# EAGLE design Power_Distro_Board (EAGLE 8.3.2)
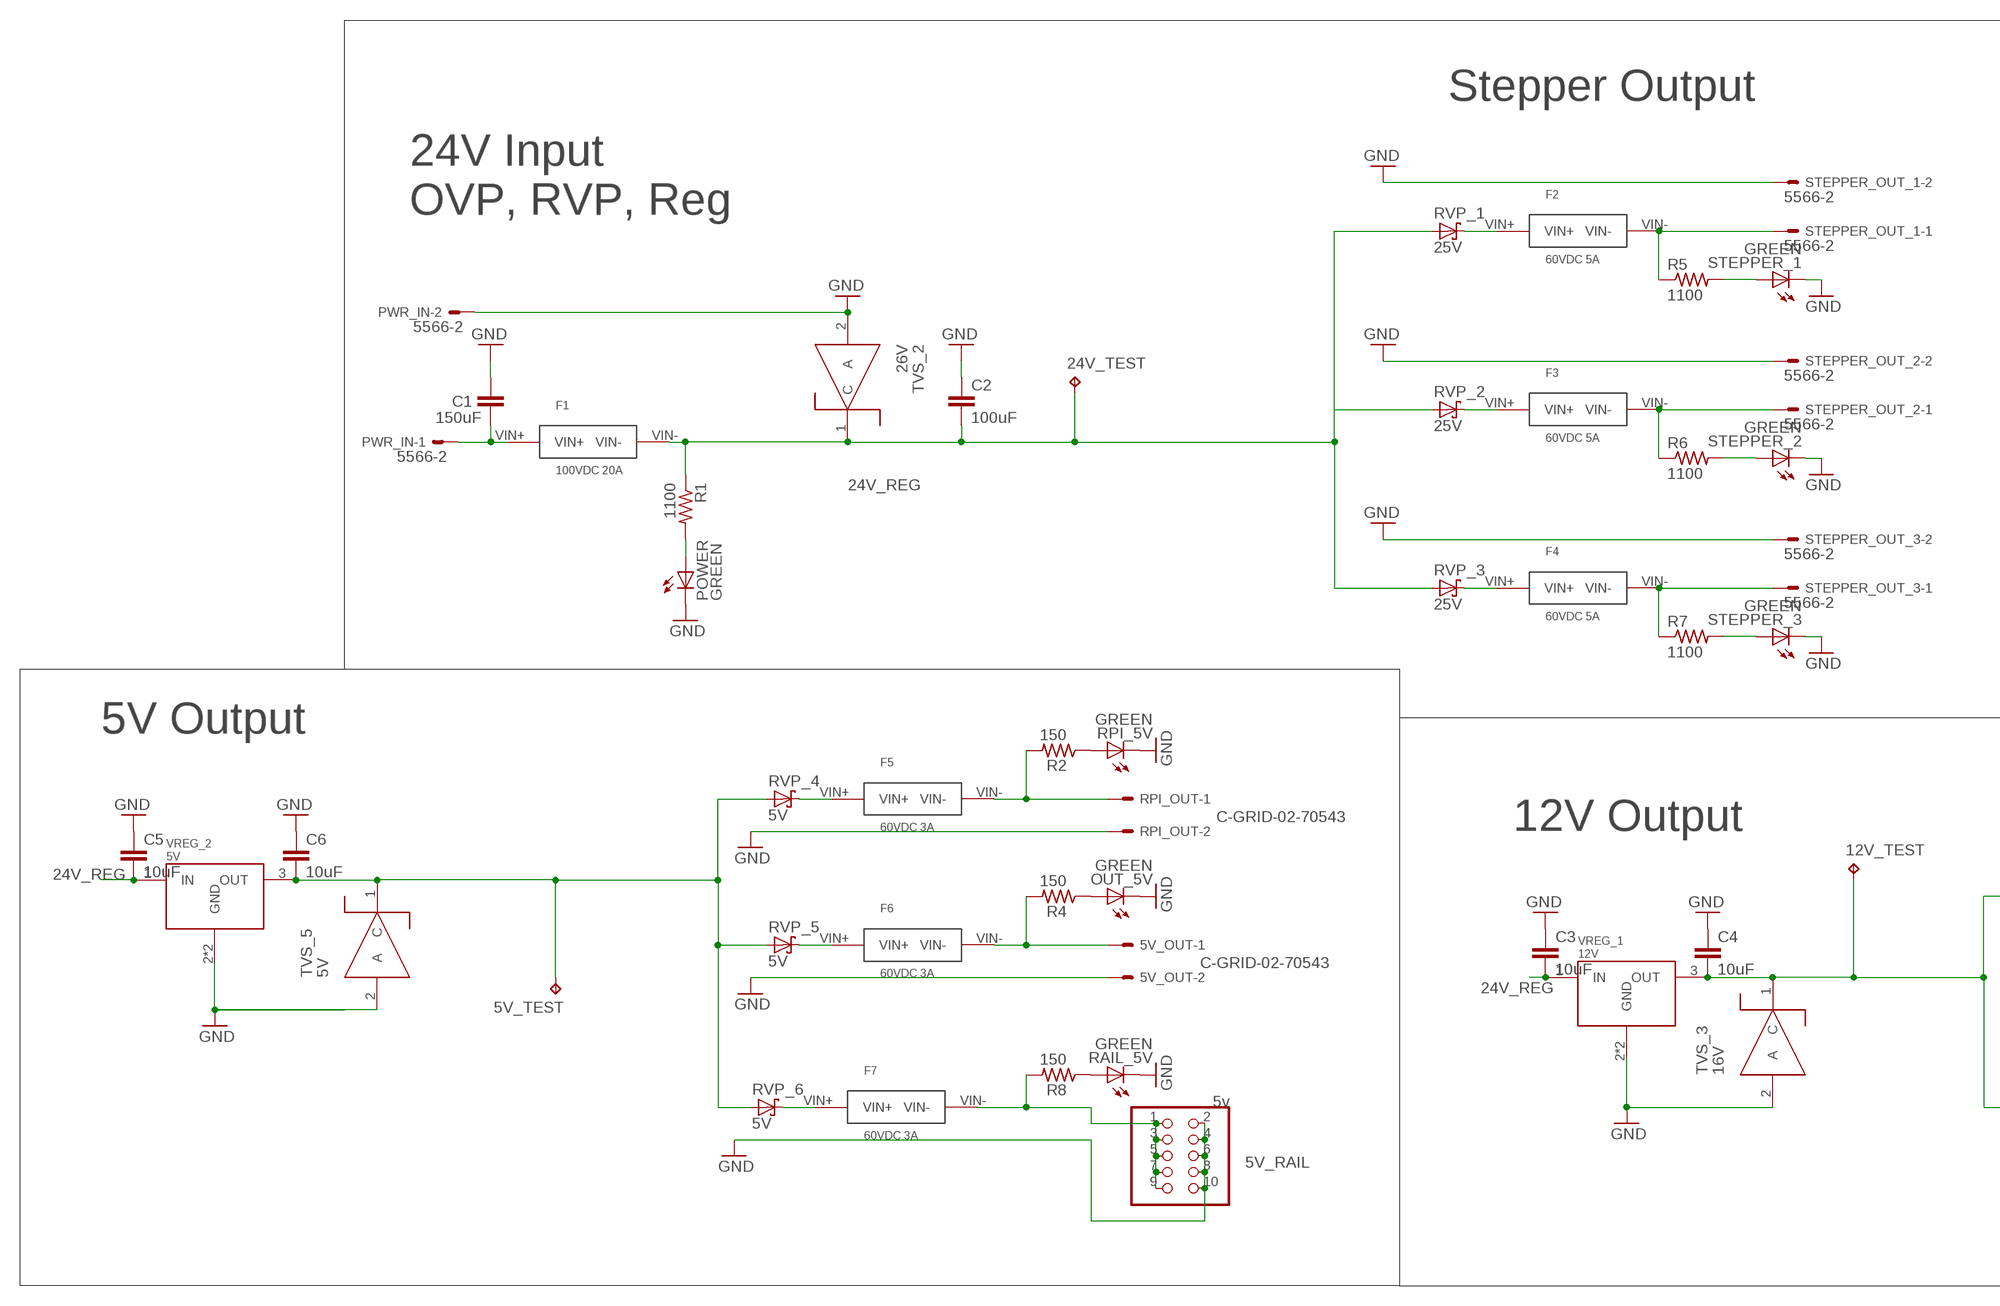
[diagram p0: schematic, sheet 1, part 1 of 2]
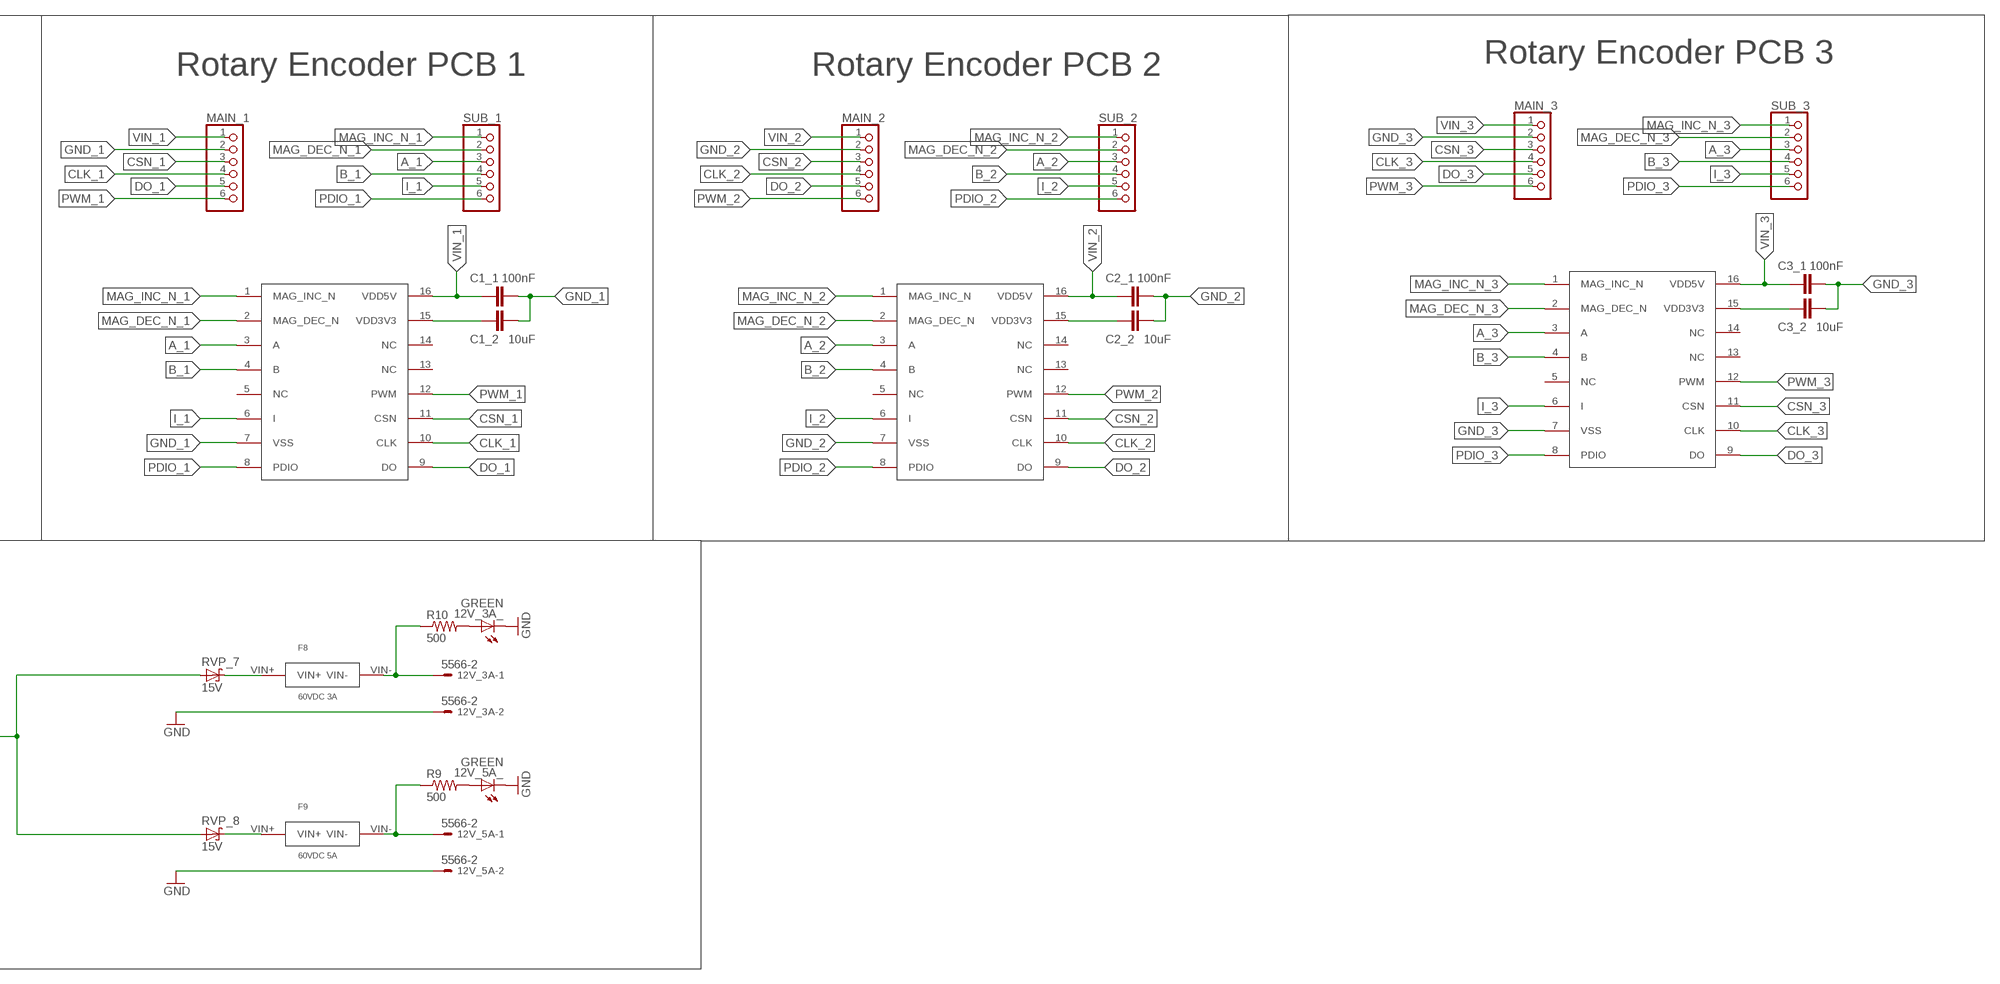
[diagram p1: schematic, sheet 1, part 2 of 2]

## Parts
5V_OUT  C-GRID-02-70543  [70543-02]
5V_RAIL  5v  PINHD-2X5  [2X05]
5V_TEST  TPPAD1-13  [P1-13]
12V_3A  5566-2  [5566-2]
12V_3A_  GREEN  LEDSML1206  [SML1206]
12V_5A  5566-2  [5566-2]
12V_5A_  GREEN  LEDSML1206  [SML1206]
12V_TEST  TPPAD1-13  [P1-13]
24V_TEST  TPPAD1-13  [P1-13]
C1  150uF  C-EUC1206  [C1206]
C1_1  100nF  C-EUC1206  [C1206]
C1_2  10uF  C-EUC1206  [C1206]
C2  100uF  C-EUC1206  [C1206]
C2_1  100nF  C-EUC1206  [C1206]
C2_2  10uF  C-EUC1206  [C1206]
C3  10uF  C-EUC1206  [C1206]
C3_1  100nF  C-EUC1206  [C1206]
C3_2  10uF  C-EUC1206  [C1206]
C4  10uF  C-EUC1206  [C1206]
C5  10uF  C-EUC1206  [C1206]
C6  10uF  C-EUC1206  [C1206]
ENC_1  ENCODER_AS5045B  [SSOP16]
ENC_2  ENCODER_AS5045B  [SSOP16]
ENC_3  ENCODER_AS5045B  [SSOP16]
F1  100VDC 20A  LITTLEFUSENANO463  [NANO]
F2  60VDC 5A  LITTLEFUSE0154  [OMNI_BLOCK]
F3  60VDC 5A  LITTLEFUSE0154  [OMNI_BLOCK]
F4  60VDC 5A  LITTLEFUSE0154  [OMNI_BLOCK]
F5  60VDC 3A  LITTLEFUSE0154  [OMNI_BLOCK]
F6  60VDC 3A  LITTLEFUSE0154  [OMNI_BLOCK]
F7  60VDC 3A  LITTLEFUSE0154  [OMNI_BLOCK]
F8  60VDC 3A  LITTLEFUSE0154  [OMNI_BLOCK]
F9  60VDC 5A  LITTLEFUSE0154  [OMNI_BLOCK]
MAIN_1  PINHD-1X6  [1X06]
MAIN_2  PINHD-1X6  [1X06]
MAIN_3  PINHD-1X6  [1X06]
OUT_5V  GREEN  LEDSML1206  [SML1206]
POWER  GREEN  LEDSML1206  [SML1206]
PWR_IN  5566-2  [5566-2]
R1  1100  R-US_R1206  [R1206]
R2  150  R-US_R1206  [R1206]
R4  150  R-US_R1206  [R1206]
R5  1100  R-US_R1206  [R1206]
R6  1100  R-US_R1206  [R1206]
R7  1100  R-US_R1206  [R1206]
R8  150  R-US_R1206  [R1206]
R9  500  R-US_R1206  [R1206]
R10  500  R-US_R1206  [R1206]
RAIL_5V  GREEN  LEDSML1206  [SML1206]
RPI_5V  GREEN  LEDSML1206  [SML1206]
RPI_OUT  C-GRID-02-70543  [70543-02]
RVP_1  25V  SCHOTTKY-DIODESMC  [SMC]
RVP_2  25V  SCHOTTKY-DIODESMC  [SMC]
RVP_3  25V  SCHOTTKY-DIODESMC  [SMC]
RVP_4  5V  SCHOTTKY-DIODESMC  [SMC]
RVP_5  5V  SCHOTTKY-DIODESMC  [SMC]
RVP_6  5V  SCHOTTKY-DIODESMC  [SMC]
RVP_7  15V  SCHOTTKY-DIODESMC  [SMC]
RVP_8  15V  SCHOTTKY-DIODESMC  [SMC]
STEPPER_1  GREEN  LEDSML1206  [SML1206]
STEPPER_2  GREEN  LEDSML1206  [SML1206]
STEPPER_3  GREEN  LEDSML1206  [SML1206]
STEPPER_OUT_1  5566-2  [5566-2]
STEPPER_OUT_2  5566-2  [5566-2]
STEPPER_OUT_3  5566-2  [5566-2]
SUB_1  PINHD-1X6  [1X06]
SUB_2  PINHD-1X6  [1X06]
SUB_3  PINHD-1X6  [1X06]
TVS_2  26V  SMAJ26A_TVSSMA  [DO-214AC]
TVS_3  16V  PRSMA16_TVS  [DO-214AC]
TVS_5  5V  SMAJ5.0_TVSSMA  [DO-214AC]
VREG_1  12V  HIGH-CURRENT_REGSMA  [TO-263-3]
VREG_2  5V  HIGH-CURRENT_REGSMA  [TO-263-3]

## Nets
5V_REG: 5V_TEST.TP C6.2 RVP_4.A RVP_5.A RVP_6.A TVS_5.1(C) VREG_2.3(OUT)
5V_REG1: F5.VIN- R2.2 RPI_OUT.1
5V_REG2: 5V_OUT.1 F6.VIN- R4.2
5V_REG3: 5V_RAIL.1 5V_RAIL.3 5V_RAIL.5 5V_RAIL.7 5V_RAIL.9 F7.VIN- R8.2
12V_REG: 12V_TEST.TP C4.2 RVP_7.A RVP_8.A TVS_3.1(C) VREG_1.3(OUT)
12V_REG1: 12V_5A.1 F9.VIN- R9.1
12V_REG2: 12V_3A.1 F8.VIN- R10.1
24V_REG: 24V_TEST.TP C2.2 C3.2 C5.2 F1.VIN- R1.1 RVP_1.A RVP_2.A RVP_3.A TVS_2.1(C) VREG_1.1(IN) VREG_2.1(IN)
A_1: ENC_1.3(A) SUB_1.3
A_2: ENC_2.3(A) SUB_2.3
A_3: ENC_3.3(A) SUB_3.3
B_1: ENC_1.4(B) SUB_1.4
B_2: ENC_2.4(B) SUB_2.4
B_3: ENC_3.4(B) SUB_3.4
CLK_1: ENC_1.10(CLK) MAIN_1.4
CLK_2: ENC_2.10(CLK) MAIN_2.4
CLK_3: ENC_3.10(CLK) MAIN_3.4
CSN_1: ENC_1.11(CSN) MAIN_1.3
CSN_2: ENC_2.11(CSN) MAIN_2.3
CSN_3: ENC_3.11(CSN) MAIN_3.3
DO_1: ENC_1.9(DO) MAIN_1.5
DO_2: ENC_2.9(DO) MAIN_2.5
DO_3: ENC_3.9(DO) MAIN_3.5
GND: 5V_OUT.2 5V_RAIL.2 5V_RAIL.4 5V_RAIL.6 5V_RAIL.8 5V_RAIL.10 12V_3A.2 12V_3A_.C 12V_5A.2 12V_5A_.C C1.1 C2.1 C3.1 C4.1 C5.1 C6.1 OUT_5V.C POWER.C PWR_IN.2 RAIL_5V.C RPI_5V.C RPI_OUT.2 STEPPER_1.C STEPPER_2.C STEPPER_3.C STEPPER_OUT_1.2 STEPPER_OUT_2.2 STEPPER_OUT_3.2 TVS_2.2(A) TVS_3.2(A) TVS_5.2(A) VREG_1.2(GND) VREG_1.4(GND) VREG_2.2(GND) VREG_2.4(GND)
GND_1: C1_1.2 C1_2.2 ENC_1.7(VSS) MAIN_1.2
GND_2: C2_1.2 C2_2.2 ENC_2.7(VSS) MAIN_2.2
GND_3: C3_1.2 C3_2.2 ENC_3.7(VSS) MAIN_3.2
I_1: ENC_1.6(I) SUB_1.5
I_2: ENC_2.6(I) SUB_2.5
I_3: ENC_3.6(I) SUB_3.5
MAG_DEC_N_1: ENC_1.2(MAG_DEC_N) SUB_1.2
MAG_DEC_N_2: ENC_2.2(MAG_DEC_N) SUB_2.2
MAG_DEC_N_3: ENC_3.2(MAG_DEC_N) SUB_3.2
MAG_INC_N_1: ENC_1.1(MAG_INC_N) SUB_1.1
MAG_INC_N_2: ENC_2.1(MAG_INC_N) SUB_2.1
MAG_INC_N_3: ENC_3.1(MAG_INC_N) SUB_3.1
N$1: POWER.A R1.2
N$2: C2_2.1 ENC_2.15(VDD3V3)
N$3: C1.2 F1.VIN+ PWR_IN.1
N$4: C1_2.1 ENC_1.15(VDD3V3)
N$5: F2.VIN+ RVP_1.C
N$6: C3_2.1 ENC_3.15(VDD3V3)
N$8: F5.VIN+ RVP_4.C
N$9: R5.2 STEPPER_1.A
N$10: R2.1 RPI_5V.A
N$11: R8.1 RAIL_5V.A
N$12: F2.VIN- R5.1 STEPPER_OUT_1.1
N$14: F3.VIN+ RVP_2.C
N$16: R6.2 STEPPER_2.A
N$17: 12V_5A_.A R9.2
N$18: F3.VIN- R6.1 STEPPER_OUT_2.1
N$20: OUT_5V.A R4.1
N$22: F4.VIN+ RVP_3.C
N$24: R7.2 STEPPER_3.A
N$25: F4.VIN- R7.1 STEPPER_OUT_3.1
N$28: F6.VIN+ RVP_5.C
N$29: 12V_3A_.A R10.2
N$32: F7.VIN+ RVP_6.C
N$35: F8.VIN+ RVP_7.C
N$36: F9.VIN+ RVP_8.C
PDIO_1: ENC_1.8(PDIO) SUB_1.6
PDIO_2: ENC_2.8(PDIO) SUB_2.6
PDIO_3: ENC_3.8(PDIO) SUB_3.6
PWM_1: ENC_1.12(PWM) MAIN_1.6
PWM_2: ENC_2.12(PWM) MAIN_2.6
PWM_3: ENC_3.12(PWM) MAIN_3.6
VIN_1: C1_1.1 ENC_1.16(VDD5V) MAIN_1.1
VIN_2: C2_1.1 ENC_2.16(VDD5V) MAIN_2.1
VIN_3: C3_1.1 ENC_3.16(VDD5V) MAIN_3.1
Unconnected: ENC_1.5(NC) ENC_1.13(NC) ENC_1.14(NC) ENC_2.5(NC) ENC_2.13(NC) ENC_2.14(NC) ENC_3.5(NC) ENC_3.13(NC) ENC_3.14(NC)

## Notes on the sheet
- **These 3 encoder PCBs will be cut out of the main board
- Rotary Encoder PCB 3
- Stepper Output | Rotary Encoder PCB 1 | Rotary Encoder PCB 2
- 24V Input 
  OVP, RVP, Reg
- 5V Output
- 12V Output

## Library data of the parts
5V_OUT RPI_OUT = con-molex:C-GRID-02: CONNECTOR wire to board 2.54 mm (0.100") pitch header; OC_FARNELL: unknown; OC_NEWARK: unknown
5V_RAIL = pinhead:PINHD-2X5: PIN HEADER
5V_TEST 12V_TEST 24V_TEST = testpad:TP: Test pad
12V_3A 12V_5A PWR_IN STEPPER_OUT_1-STEPPER_OUT_3 = con-molex:5566-2: Mini FIT connector 2 pol Source: http://www.molex.com; OC_FARNELL: 1822072; OC_NEWARK: unknown
12V_3A_ 12V_5A_ OUT_5V POWER RAIL_5V RPI_5V STEPPER_1-STEPPER_3 = led:LED: LED OSRAM: - CHIPLED LG R971, LG N971, LY N971, LG Q971, LY Q971, LO R971, LY R971 LH N974, LH R974 LS Q976, LO Q976, LY Q976 LO Q996 - Hyper CHIPLED LW Q18S LB Q993, LB Q99A, LB R99A - SideLED LS A670, LO A670, LY A670, LG A670, LP A670 LB A673, LV A673, LT A673, LW A673 LH A674 LY A675 LS A676, LA A676, LO A676, LY A676, LW A676 LS A679, LY A679, LG A679 - Hyper Micro SIDELED® LS Y876, LA Y876, LO Y876, LY Y876 LT Y87S - SmartLED LW L88C, LW L88S LB L89C, LB L89S, LG L890 LS L89K, LO L89K, LY L89K LS L896, LA L896, LO L896, LY L896 - TOPLED LS T670, LO T670, LY T670, LG T670, LP T670 LSG T670, LSP T670, LSY T670, LOP T670, LYG T670 LG T671, LOG T671, LSG T671 LB T673, LV T673, LT T673, LW T673 LH T674 LS T676, LA T676, LO T676, LY T676, LB T676, LH T676, LSB T676, LW T676 LB T67C, LV T67C, LT T67C, LS T67K, LO T67K, LY T67K, LW E67C LS E67B, LA E67B, LO E67B, LY E67B, LB E67C, LV E67C, LT E67C LW T67C LS T679, LY T679, LG T679 LS T770, LO T770, LY T770, LG T770, LP T770 LB T773, LV T773, LT T773, LW T773 LH T774 LS E675, LA E675, LY E675, LS T675 LS T776, LA T776, LO T776, LY T776, LB T776 LHGB T686 LT T68C, LB T68C - Hyper Mini TOPLED® LB M676 - Mini TOPLED Santana® LG M470 LS M47K, LO M47K, LY M47K Source: http://www.osram.convergy.de LUXEON: - LUMILED® LXK2-PW12-R00, LXK2-PW12-S00, LXK2-PW14-U00, LXK2-PW14-V00 LXK2-PM12-R00, LXK2-PM12-S00, LXK2-PM14-U00 LXK2-PE12-Q00, LXK2-PE12-R00, LXK2-PE12-S00, LXK2-PE14-T00, LXK2-PE14-U00 LXK2-PB12-K00, LXK2-PB12-L00, LXK2-PB12-M00, LXK2-PB14-N00, LXK2-PB14-P00, LXK2-PB14-Q00 LXK2-PR12-L00, LXK2-PR12-M00, LXK2-PR14-Q00, LXK2-PR14-R00 LXK2-PD12-Q00, LXK2-PD12-R00, LXK2-PD12-S00 LXK2-PH12-R00, LXK2-PH12-S00 LXK2-PL12-P00, LXK2-PL12-Q00, LXK2-PL12-R00 Source: www.luxeon.com KINGBRIGHT: KA-3528ASYC Source: www.kingbright.com
C1 C1_1 C1_2 C2 C2_1 C2_2 C3 C3_1 C3_2 C4-C6 = resistor:C-EU: CAPACITOR, European symbol
ENC_1-ENC_3 = minebot_PDR:ENCODER_AS5045B
F1 = minebot_PDR:LITTLEFUSENANO463
F2-F9 = minebot_PDR:LITTLEFUSE0154
MAIN_1-MAIN_3 SUB_1-SUB_3 = pinhead:PINHD-1X6: PIN HEADER
R1 R2 R4-R10 = resistor:R-US_: RESISTOR, American symbol
RVP_1-RVP_8 = diode:SCHOTTKY-DIODE: Schottky Diode
TVS_2 = POWER_DISTRO:SMAJ26A_TVS: TVS Diode, SMAJ26A
TVS_3 = POWER_DISTRO:PRSMA16_TVS: TVS Diode, PRSMA16
TVS_5 = POWER_DISTRO:SMAJ5.0_TVS: TVS Diode, SMAJ Series
VREG_1 VREG_2 = POWER_DISTRO:HIGH-CURRENT_REG: MIC29X, High Voltage Reg.

## Net classes
0 default: width 0.025 mm, drill 0.254 mm, clearance 0.254 mm
1 Power IN: width 4.801 mm
2 Motor_OUT: width 4.801 mm
3 3.3V_1A: width 0.305 mm
4 5V_1A: width 0.305 mm
5 12V_2A: width 0.813 mm

## Board
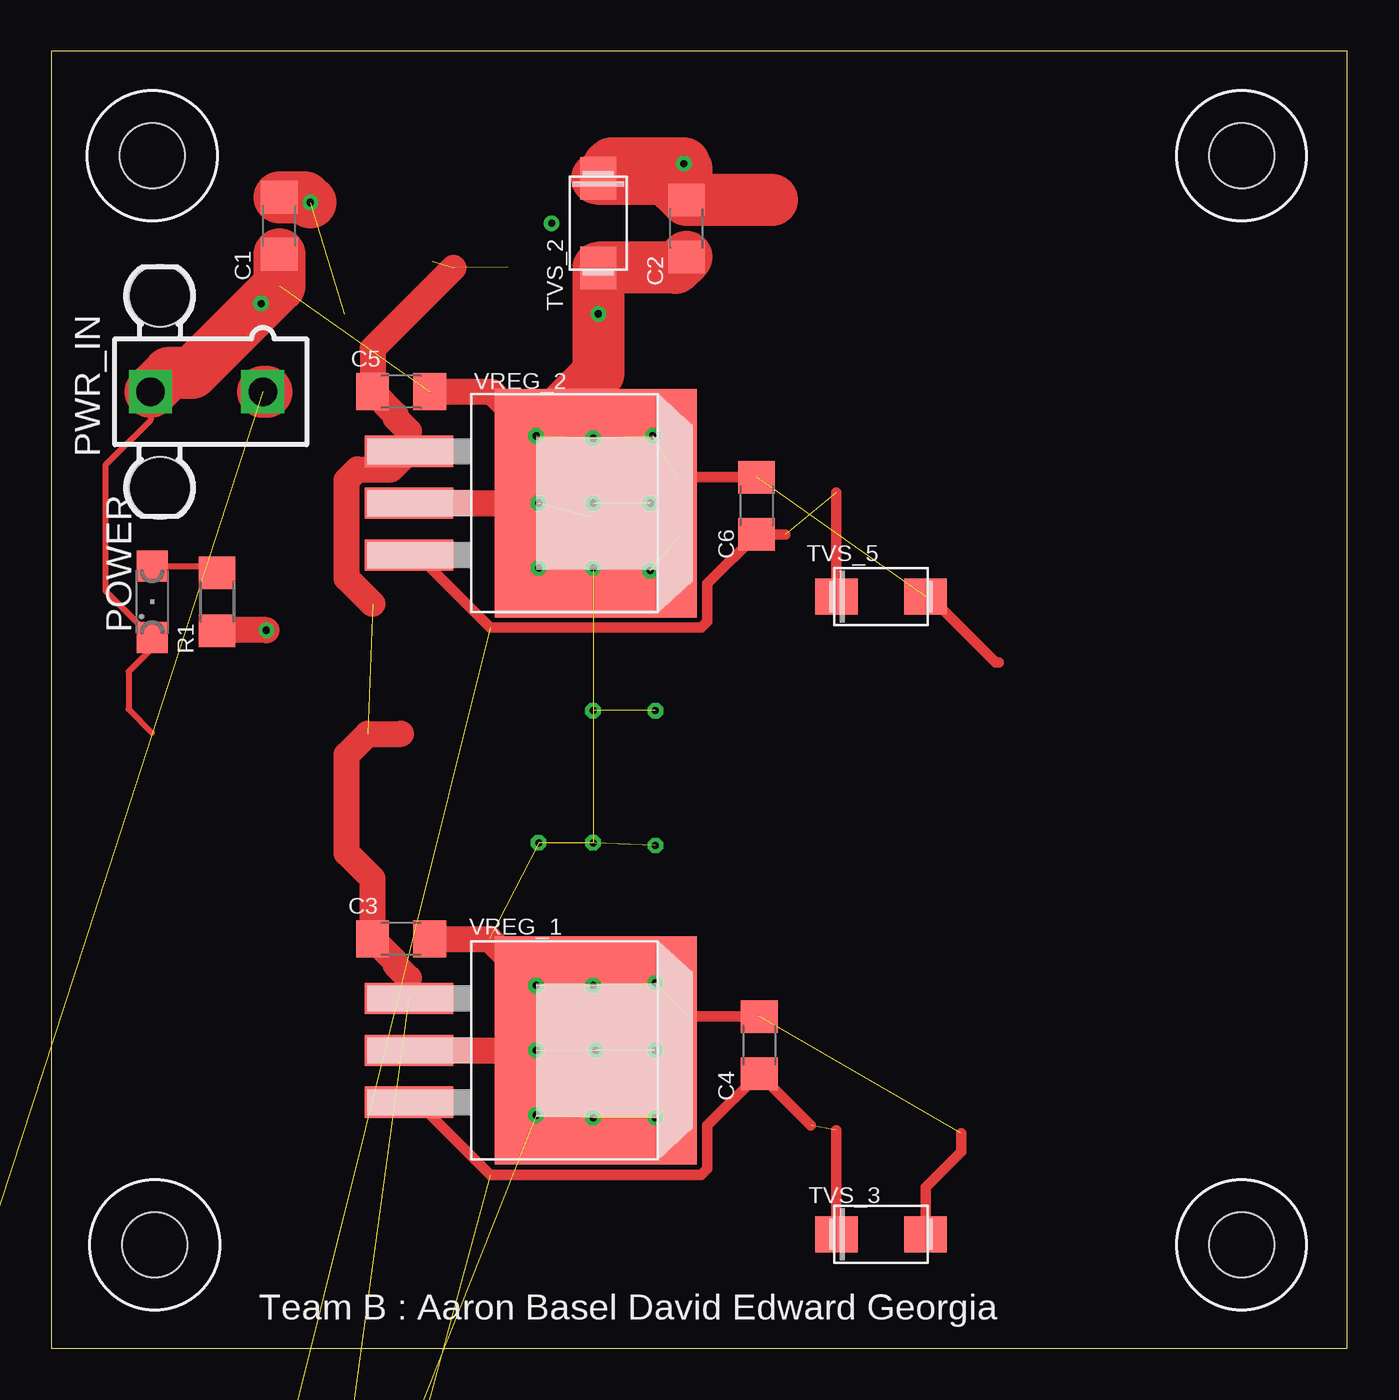
[diagram p2: board, top side]
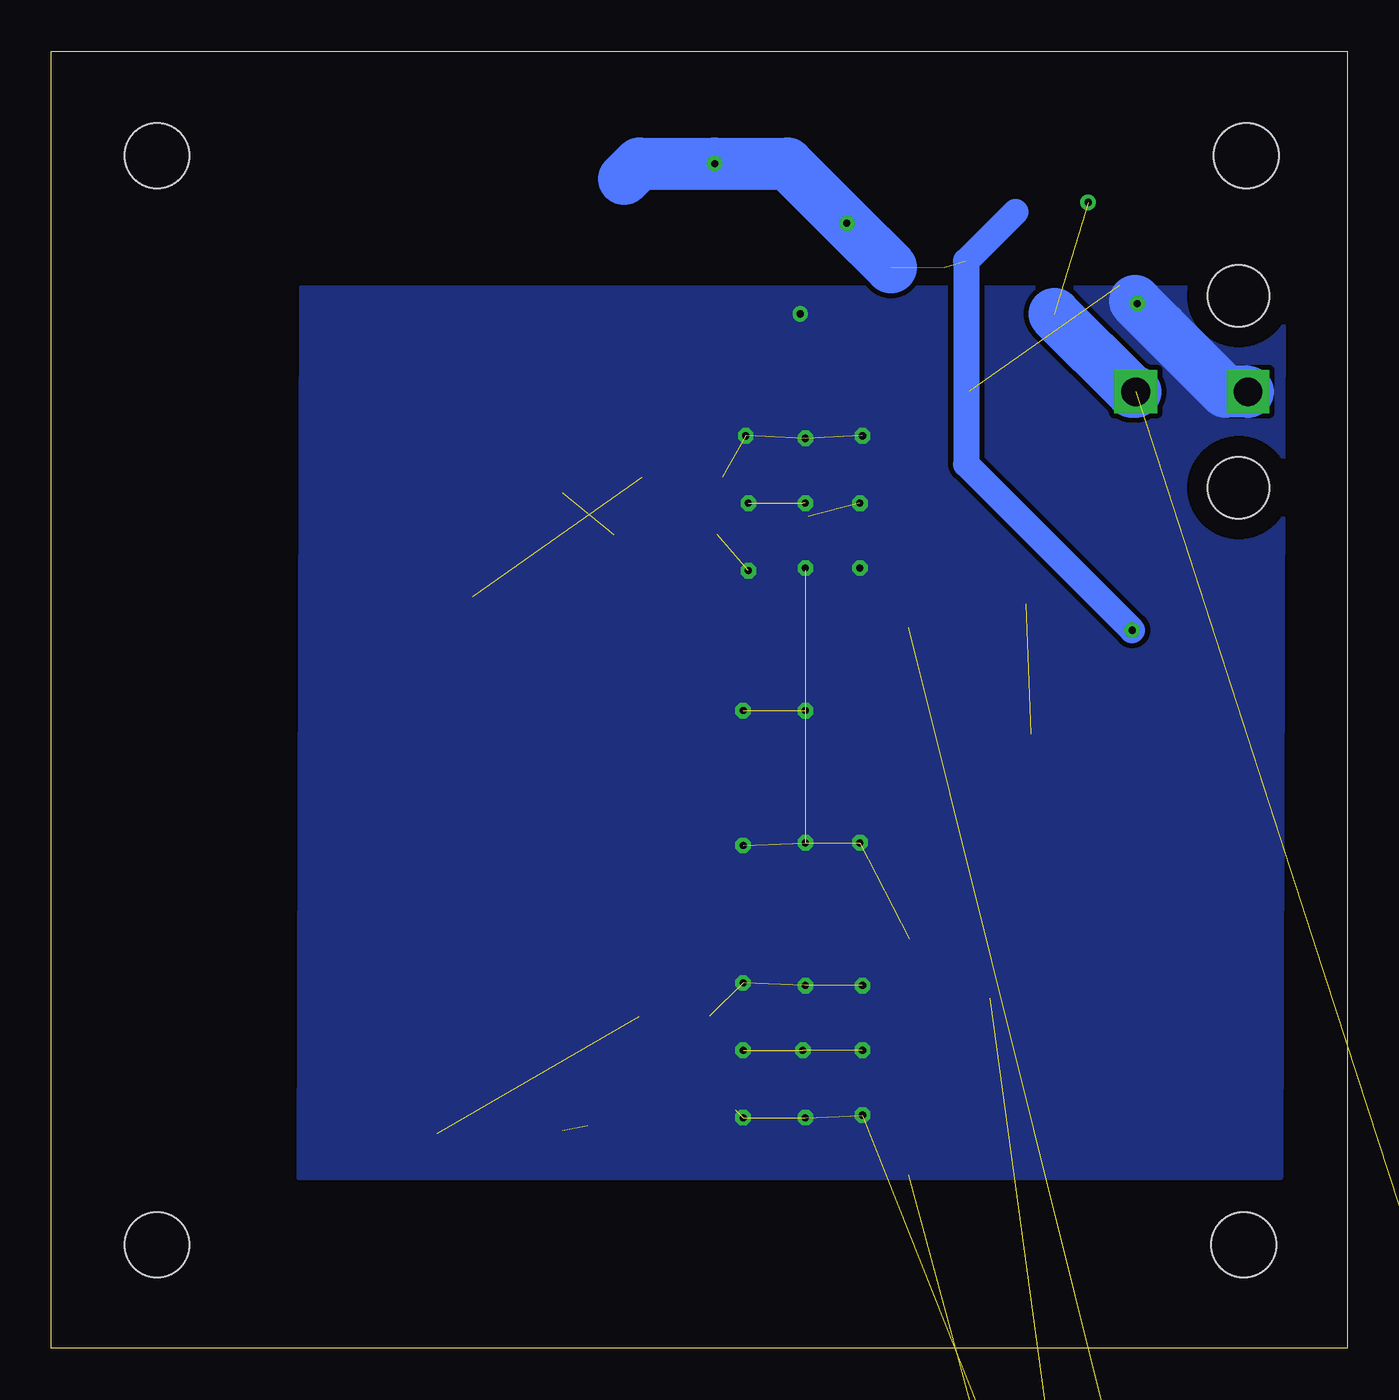
[diagram p3: board, bottom side, seen from below]

Size 63.48 x 63.55 mm. Coordinates in mm from the lower left corner, seen from the top.
Outline: 0,0 63.48,0 63.48,63.55 0,63.55 0,0
Copper layers (1*16): Top 0.035mm / dielectric 1.5mm / Bottom 0.035mm
Design rules "default *": minimum track width 6mil, minimum drill 0.35mm, track to track 6mil, track to pad 6mil, pad to pad 6mil, via to via 6mil, smd to smd 6mil, copper to edge 40mil, drill to drill 6mil, minimum pad ring 10mil, minimum via ring 8mil, stop-mask expansion 4mil, vias tented up to drill 0mil, thermal gap 10mil
Holes 3.17 mm at 5.08,5.08 58.29,5.08 4.95,58.42 58.29,58.42

### Footprints (pad centres in the part's own frame; a part is rotated, then mirrored left to right if it is on the bottom)
70543-02 = drill 1.016 long: 1 -1.27,0; 2 1.27,0
2X05 = drill 1.016 octagon: 1 -5.08,-1.27; 2 -5.08,1.27; 3 -2.54,-1.27; 4 -2.54,1.27; 5 0,-1.27; 6 0,1.27; 7 2.54,-1.27; 8 2.54,1.27; 9 5.08,-1.27; 10 5.08,1.27
P1-13 = drill 1.321 pad 2.159 octagon: TP 0,0
5566-2 = drill 1.4 square: 1 0,-2.75; 2 0,2.75 | hole 3: 4.7,2.29; -4.7,2.29
SML1206 = smd 1.5 x 1.5: A 1.75,0; C -1.75,0
C1206 = smd 1.6 x 1.8: 1 -1.4,0; 2 1.4,0
SSOP16 = smd 2 x 0.46: 1 -4.08,2.275; 2 -4.08,1.625; 3 -4.08,0.975; 4 -4.08,0.325; 5 -4.08,-0.325; 6 -4.08,-0.975; 7 -4.08,-1.625; 8 -4.08,-2.275; 9 4.08,-2.275; 10 4.08,-1.625; 11 4.08,-0.975; 12 4.08,-0.325; 13 4.08,0.325; 14 4.08,0.975; 15 4.08,1.625; 16 4.08,2.275
NANO = smd 3.25 x 3.43: VIN+ -4.675,0; VIN- 4.675,0
OMNI_BLOCK = smd 4.24 x 3.81: VIN+ -3.185,0; VIN- 3.185,0
1X06 = drill 1.016 long: 1 -6.35,0; 2 -3.81,0; 3 -1.27,0; 4 1.27,0; 5 3.81,0; 6 6.35,0
R1206 = smd 1.6 x 1.803: 1 -1.422,0; 2 1.422,0
SMC = smd 2.8 x 3.8: A 3.7,0; C -3.7,0
DO-214AC = smd 2.083 x 1.778: 1 -2.184,0; 2 2.184,0
TO-263-3 = smd 1.524 x 4.318: 1 -2.54,-7.62; 2 0,-7.62; 3 2.54,-7.62 | smd 11.176 x 9.906: 4 0,1.524

### Placement (x,y rotation side)
5V_OUT  -101.6,-379.73 0 top  (outside the outline)
5V_RAIL  -97.79,-418.72 0 top  (outside the outline)
5V_TEST  5.21,-30.1 0 top  (outside the outline)
12V_3A  -121.16,-436.75 0 top  (outside the outline)
12V_3A_  -169.29,-508 0 top  (outside the outline)
12V_5A  -142.24,-436.75 0 top  (outside the outline)
12V_5A_  -169.29,-495.81 0 top  (outside the outline)
12V_TEST  5.21,-51.69 0 top  (outside the outline)
24V_TEST  5.21,-73.28 0 top  (outside the outline)
C1  11.18,54.99 90 top
C1_1  -171.07,-536.58 0 top  (outside the outline)
C1_2  -171.07,-542.8 0 top  (outside the outline)
C2  31.11,54.86 90 top
C2_1  -149.73,-655.7 0 top  (outside the outline)
C2_2  -143.89,-655.7 0 top  (outside the outline)
C3  17.14,20.07 180 top
C3_1  -149.73,-697.23 0 top  (outside the outline)
C3_2  -143.89,-697.23 0 top  (outside the outline)
C4  34.67,14.86 270 top
C5  17.14,46.86 180 top
C6  34.54,41.27 270 top
ENC_1  -167.13,-528.07 0 top  (outside the outline)
ENC_2  -167.13,-658.11 0 top  (outside the outline)
ENC_3  -167.13,-699.64 0 top  (outside the outline)
F1  -167.13,-516.76 0 top  (outside the outline)
F2  -89.92,-211.84 0 top  (outside the outline)
F3  -79.38,-297.05 0 top  (outside the outline)
F4  -79.38,-342.65 0 top  (outside the outline)
F5  -89.92,-192.28 0 top  (outside the outline)
F6  -100.33,-404.88 0 top  (outside the outline)
F7  -100.33,-445.13 0 top  (outside the outline)
F8  -89.92,-260.73 0 top  (outside the outline)
F9  -89.92,-250.95 0 top  (outside the outline)
MAIN_1  -159.51,-599.19 0 top  (outside the outline)
MAIN_2  -159.51,-629.67 0 top  (outside the outline)
MAIN_3  -159.51,-671.2 0 top  (outside the outline)
OUT_5V  -169.29,-471.42 0 top  (outside the outline)
POWER  4.95,36.58 90 top
PWR_IN  7.62,46.86 90 top
R1  8.13,36.58 90 top
R2  -171.07,-453.26 0 top  (outside the outline)
R4  -171.07,-465.45 0 top  (outside the outline)
R5  -66.42,-126.24 0 top  (outside the outline)
R6  -97.66,-308.23 0 top  (outside the outline)
R7  -97.66,-353.82 0 top  (outside the outline)
R8  -171.07,-477.65 0 top  (outside the outline)
R9  -171.07,-489.84 0 top  (outside the outline)
R10  -171.07,-502.03 0 top  (outside the outline)
RAIL_5V  -169.29,-483.62 0 top  (outside the outline)
RPI_5V  -169.29,-459.23 0 top  (outside the outline)
RPI_OUT  -91.19,-364.49 0 top  (outside the outline)
RVP_1  -74.17,-135.38 0 top  (outside the outline)
RVP_2  -94.87,-298.7 0 top  (outside the outline)
RVP_3  -94.87,-344.3 0 top  (outside the outline)
RVP_4  -105.41,-365.76 0 top  (outside the outline)
RVP_5  -105.41,-393.7 0 top  (outside the outline)
RVP_6  -105.41,-433.96 0 top  (outside the outline)
RVP_7  -157.99,-443.61 0 top  (outside the outline)
RVP_8  -168.4,-443.61 0 top  (outside the outline)
STEPPER_1  -64.64,-120.02 0 top  (outside the outline)
STEPPER_2  -90.17,-307.98 0 top  (outside the outline)
STEPPER_3  -90.17,-353.57 0 top  (outside the outline)
STEPPER_OUT_1  -16.26,-92.2 0 top  (outside the outline)
STEPPER_OUT_2  -89.66,-279.02 0 top  (outside the outline)
STEPPER_OUT_3  -89.66,-324.61 0 top  (outside the outline)
SUB_1  -159.51,-614.43 0 top  (outside the outline)
SUB_2  -159.51,-644.91 0 top  (outside the outline)
SUB_3  -159.51,-686.43 0 top  (outside the outline)
TVS_2  26.8,55.12 270 top
TVS_3  40.64,5.59 0 top
TVS_5  40.64,36.83 0 top
VREG_1  25.15,14.61 270 top
VREG_2  25.15,41.4 270 top

### Tracks (layer width: path | path; a pad name or v marks a point on that pad's centre or on a via)
5V_REG  (5 unrouted)
  Top 0.508: VREG_2.3 17.95,38.86 21.51,35.31 31.83,35.31 32.13,35.6 32.13,37.46 C6.2 35.94,39.88 | TVS_5.1 38.46,41.94
5V_REG1  (2 unrouted)
5V_REG2  (2 unrouted)
5V_REG3  (6 unrouted)
12V_REG  (4 unrouted)
  Top 0.508: VREG_1.3 17.95,12.06 21.51,8.51 31.83,8.51 32.13,8.81 32.13,10.92 C4.2 37.21,10.92 | TVS_3.1 38.46,10.69
12V_REG1  (2 unrouted)
12V_REG2  (2 unrouted)
24V_REG  (via drill 0.35)  (8 unrouted)
  Top 1.27: 19.71,52.93 15.74,48.97 C5.2 16.86,45.75 16.86,45.59 17.53,44.92 VREG_2.1 16.64,43.05 15,43.05 14.48,42.53 14.48,37.73 15.74,36.47 | 17.14,30.1 15.51,30.1 14.48,29.07 14.48,24.27 15.74,23 C3.2 16.86,18.95 16.86,18.8 17.53,18.13 VREG_1.1 | v10.54,35.18 8.15,35.18 R1.1
  Top 2.54: C2.2 30.08,57.3 TVS_2.1 26.72,57.3 | C2.2 35.31,56.26 | C2.2 31.11,57.78 30.99,57.91 v30.99,58.04 27.43,58.04 27.3,57.91
  Bottom 1.27: 16.26,55.67 18.67,53.26 18.67,43.31 v10.54,35.18
  Bottom 2.54: 35.43,57.28 34.67,58.04 v30.99,58.04 27.43,58.04 v24.51,55.12 22.35,52.96
A_1  (1 unrouted)
A_2  (1 unrouted)
A_3  (1 unrouted)
B_1  (1 unrouted)
B_2  (1 unrouted)
B_3  (1 unrouted)
CLK_1  (1 unrouted)
CLK_2  (1 unrouted)
CLK_3  (1 unrouted)
CSN_1  (1 unrouted)
CSN_2  (1 unrouted)
CSN_3  (1 unrouted)
DO_1  (1 unrouted)
DO_2  (1 unrouted)
DO_3  (1 unrouted)
GND  (via drill 0.35)  (44 unrouted)
  Top 0.152: VREG_2.4 arc-45 26.4,40.75 v23.88,38.23 | VREG_2.4 26.67,41.17 arc-45 26.3,40.27 23.5,37.47 | VREG_2.4 26.67,38.53 arc-45 v26.54,38.23 | VREG_2.4 26.67,38.41 arc-45 26.54,38.1 | VREG_1.4 29.97,11.68
  Top 0.305: PWR_IN.2 4.87,45.48 2.66,43.27 2.66,37.12 POWER.C 4.95,34.3 3.8,33.15 3.8,31.31 4.95,30.16 | 26.54,38.1 26.67,38.23
  Top 0.508: 46.41,33.6 46.26,33.6 43.02,36.83 TVS_5.2 | C6.1 30.61,42.67 v29.34,41.4 | C4.1 31.25,16.26 v29.59,14.61 | 44.58,10.54 44.58,9.63 42.82,7.88 TVS_3.2
  Top 1.27: C3.1 21.46,20.07 v23.75,17.78 | VREG_1.2 v23.75,14.61 | VREG_2.2 v23.88,41.4 | C5.1 21.59,46.86 v23.75,44.7 | v29.34,41.4 30.86,39.88
  Top 2.54: PWR_IN.2 5.78,47.78 6.9,47.78 11.18,52.05 C1.1 | C2.1 30.59,52.93 TVS_2.2 v26.8,50.67 26.8,47.75 v23.75,44.7
  Bottom 2.54: PWR_IN.2 5.98,46.86 9.12,49.99 9.12,50.01 v10.29,51.18 10.41,51.31
  other vias: 26.67,14.61 26.54,11.3 26.54,17.78 23.75,11.43 29.59,11.3 29.59,17.91 26.54,31.24 29.59,31.24 29.59,24.64 26.54,24.77 23.88,24.77 26.54,41.4 26.54,44.58 29.46,44.7 29.34,38.1
  pour Bottom: 3.17,51.94 3.3,8.38 51.31,8.38 51.18,51.94
GND_1  (3 unrouted)
GND_2  (3 unrouted)
GND_3  (3 unrouted)
I_1  (1 unrouted)
I_2  (1 unrouted)
I_3  (1 unrouted)
MAG_DEC_N_1  (1 unrouted)
MAG_DEC_N_2  (1 unrouted)
MAG_DEC_N_3  (1 unrouted)
MAG_INC_N_1  (1 unrouted)
MAG_INC_N_2  (1 unrouted)
MAG_INC_N_3  (1 unrouted)
N$1
  Top 0.305: POWER.A 7.8,38.33 R1.2
N$2  (1 unrouted)
N$3  (via drill 0.35)  (2 unrouted)
  Top 2.54: PWR_IN.1 10.54,46.86 | C1.2 12.44,56.39 v12.7,56.13
  Bottom 2.54: PWR_IN.1 10.54,46.86 14.35,50.67
N$4  (1 unrouted)
N$5  (1 unrouted)
N$6  (1 unrouted)
N$8  (1 unrouted)
N$9  (1 unrouted)
N$10  (1 unrouted)
N$11  (1 unrouted)
N$12  (2 unrouted)
N$14  (1 unrouted)
N$16  (1 unrouted)
N$17  (1 unrouted)
N$18  (2 unrouted)
N$20  (1 unrouted)
N$22  (1 unrouted)
N$24  (1 unrouted)
N$25  (2 unrouted)
N$28  (1 unrouted)
N$29  (1 unrouted)
N$32  (1 unrouted)
N$35  (1 unrouted)
N$36  (1 unrouted)
PDIO_1  (1 unrouted)
PDIO_2  (1 unrouted)
PDIO_3  (1 unrouted)
PWM_1  (1 unrouted)
PWM_2  (1 unrouted)
PWM_3  (1 unrouted)
VIN_1  (2 unrouted)
VIN_2  (2 unrouted)
VIN_3  (2 unrouted)

### Text on the board
tNames: Team B : Aaron Basel David Edward Georgia
tDocu: **NOTE : / / There will be 27 DRC overlap errors. / Those are all vias within the GND pad of / the 3 linear voltage regulators included. / These are added on purpose, with thermals generated, / will help with power dissipation to the ground plane / at the bottom.